# Altium schematic sheet Pre-Avionic-Design.SchDoc
size A4
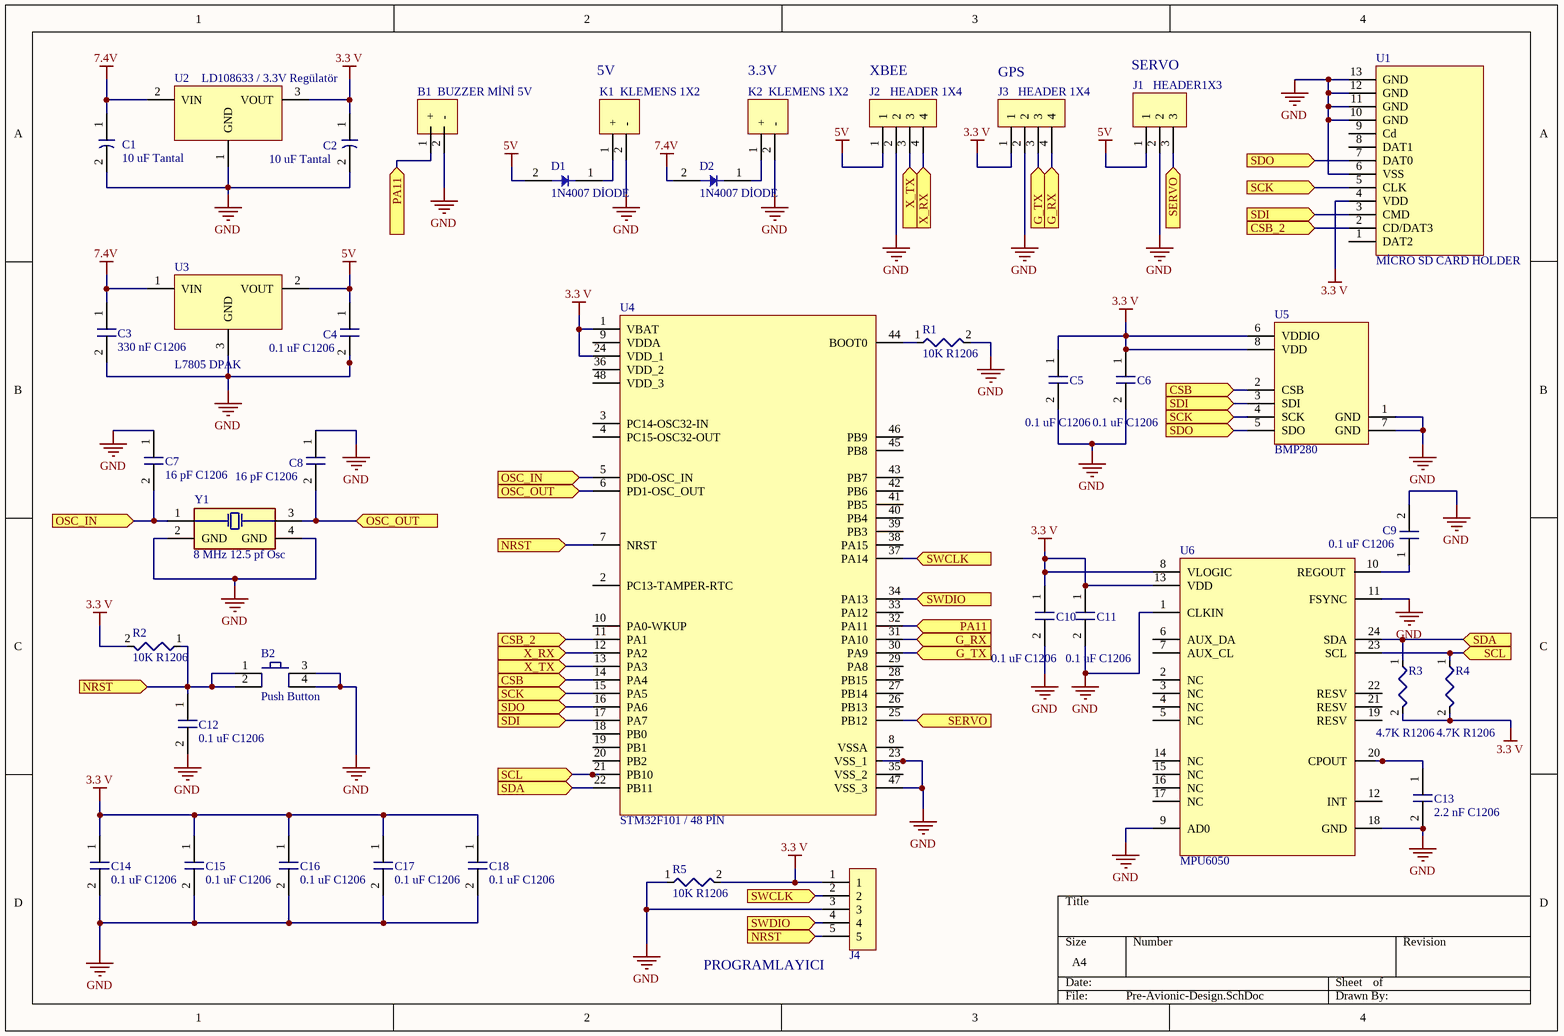
[diagram p0: Pre-Avionic-Design.SchDoc]

## Parts
B1  BUZZER MİNİ 5V  [BUZZER MİNİ]
B2  Push Button  [PUSH_BUTTON]
C1  10 uF Tantal  [C1206-tantal]
C2  10 uF Tantal  [C1206-tantal]
C3  330 nF C1206  [c1206]
C4  0.1 uF C1206  [c1206]
C5  0.1 uF C1206  [c1206]
C6  0.1 uF C1206  [c1206]
C7  16 pF C1206  [c1206]
C8  16 pF C1206  [c1206]
C9  0.1 uF C1206  [c1206]
C10  0.1 uF C1206  [c1206]
C11  0.1 uF C1206  [c1206]
C12  0.1 uF C1206  [c1206]
C13  2.2 nF C1206  [c1206]
C14  0.1 uF C1206  [c1206]
C15  0.1 uF C1206  [c1206]
C16  0.1 uF C1206  [c1206]
C17  0.1 uF C1206  [c1206]
C18  0.1 uF C1206  [c1206]
D1  1N4007 DİODE  [1N4007]
D2  1N4007 DİODE  [1N4007]
J1  HEADER1X3  [HEADER 1X3]
J2  HEADER 1X4  [Header 1x4]
J3  HEADER 1X4  [Header 1x4]
J4  HEADER 1x5  [Header 1x5]  (value not drawn)
K1  KLEMENS 1X2  [KLEMENS 1X2]
K2  KLEMENS 1X2  [KLEMENS 1X2]
R1  10K R1206  [R1206]
R2  10K R1206  [R1206]
R3  4.7K R1206  [R1206]
R4  4.7K R1206  [R1206]
R5  10K R1206  [R1206]
U1  MİCRO SD CARD HOLDER  [Micro SD Card Holder]
U2  LD108633 / 3.3V Regülatör  [LD108633 / DPAK - duplicate]
U3  L7805 DPAK  [L7805 / DPAK]
U4  STM32F101 / 48 PİN  [LQFP48-STM]
U5  BMP280  [BMP280]
U6  MPU6050  [MPU6050 / QFN]
Y1  8 MHz 12.5 pf Osc  [8 MHz OSC]

## Ports
CSB (in), CSB_2 (in), G_RX (in), G_TX (in), NRST (in), OSC_IN (in), OSC_OUT (in), PA11 (in), SCK (in), SCL (in), SDA (in), SDI (in), SDO (in), SERVO (in), SWCLK (in), SWDIO (in), X_RX (in), X_TX (in)

## Nets
3.3 V: C2.1 C5.1 C6.1 C10.1 C11.1 C14.1 C15.1 C16.1 C17.1 C18.1 J3.1 J4.1 R2.2 R3.2 R4.2 R5.2 U1.4(VDD) U2.3(VOUT) U4.1(VBAT) U4.24(VDD_1) U5.6(VDDIO) U5.8(VDD) U6.8(VLOGIC) U6.13(VDD)
5V: C4.1 D1.2 J1.1 J2.1 U3.2(VOUT)
7.4V: C1.1 C3.1 D2.2 U2.2(VIN) U3.1(VIN)
GND: B1.2(-) B2.3 B2.4 C1.2 C2.2 C3.2 C4.2 C5.2 C6.2 C7.1 C8.1 C9.2 C10.2 C11.2 C12.2 C13.2 C14.2 C15.2 C16.2 C17.2 C18.2 J1.2 J2.2 J3.2 J4.3 K1.2(-) K2.2(-) R1.2 R5.1 U1.6(VSS) U1.10(GND) U1.11(GND) U1.12(GND) U1.13(GND) U2.1(GND) U3.3(GND) U4.23(VSS_1) U4.47(VSS_3) U5.1(GND) U5.7(GND) U6.1(CLKIN) U6.9(AD0) U6.11(FSYNC) U6.18(GND) Y1.2(GND) Y1.4(GND)
CSB: U4.14(PA4) U5.2(CSB) ; port CSB
CSB_2: U1.2(CD/DAT3) U4.11(PA1) ; port CSB_2
G_RX: J3.4 U4.31(PA10) ; port G_RX
G_TX: J3.3 U4.30(PA9) ; port G_TX
NRST: B2.1 B2.2 C12.1 J4.5 R2.1 U4.7(NRST) ; port NRST
OSC_IN: C7.2 U4.5(PD0-OSC_IN) Y1.1 ; port OSC_IN
OSC_OUT: C8.2 U4.6(PD1-OSC_OUT) Y1.3 ; port OSC_OUT
PA11: B1.1(+) U4.32(PA11) ; port PA11
SCK: U1.5(CLK) U4.15(PA5) U5.4(SCK) ; port SCK
SCL: R4.1 U4.21(PB10) U6.23(SCL) ; port SCL
SDA: R3.1 U4.22(PB11) U6.24(SDA) ; port SDA
SDI: U1.3(CMD) U4.17(PA7) U5.3(SDI) ; port SDI
SDO: U1.7(DAT0) U4.16(PA6) U5.5(SDO) ; port SDO
SERVO: J1.3 U4.25(PB12) ; port SERVO
SWCLK: J4.2 U4.37(PA14) ; port SWCLK
SWDIO: J4.4 U4.34(PA13) ; port SWDIO
X_RX: J2.4 U4.12(PA2) ; port X_RX
X_TX: J2.3 U4.13(PA3) ; port X_TX
NetC9_1: C9.1 U6.10(REGOUT)
NetC13_1: C13.1 U6.20(CPOUT)
NetD1_1: D1.1 K1.1(+)
NetD2_1: D2.1 K2.1(+)
NetR1_1: R1.1 U4.44(BOOT0)

Not connected (* = marked no-connect by the designer): U1 1(DAT2) 8(DAT1) 9(Cd); U4 2(PC13-TAMPER-RTC) 3(PC14-OSC32-IN) 4(PC15-OSC32-OUT) 8(VSSA) 9(VDDA) 10(PA0-WKUP) 18(PB0) 19(PB1) 20(PB2) 26(PB13) 27(PB14) 28(PB15) 29(PA8) 33(PA12) 35(VSS_2) 36(VDD_2) 38(PA15) 39(PB3) 40(PB4) 41(PB5) 42(PB6) 43(PB7) 45(PB8) 46(PB9) 48(VDD_3); U6 2(NC) 3(NC) 4(NC) 5(NC) 6(AUX_DA) 7(AUX_CL) 12(INT) 14(NC) 15(NC) 16(NC) 17(NC) 19(RESV) 21(RESV) 22(RESV)

## Notes on the sheet
- 5V
- 3.3V
- (near J2) XBEE
- (near J3) GPS
- (near J1) SERVO
- PROGRAMLAYICI

## Library data of the parts
B1 = BUZZER MİNİ 5V: BUZZER 5V
B2 = Push Button: SMD Push Button
C4-C6 C9-C12 C14-C18 = 0.1 uF C1206: 0.1 uF 1206
J1 = HEADER1X3: Header 1x3 2.54mm
J2 J3 = HEADER 1X4: Header1x4 2.54mm
J4 = HEADER 1x5: Header 1x5 2.54mm
K1 K2 = KLEMENS 1X2: KLEMANS 1X22 3.6mm
U1 = MİCRO SD CARD HOLDER: MICRO SD CARD HOLDER
U2 = LD108633: LD108633 / 3.3 REG
U3 = L7805 DPAK: L7805 / 5V Regülatör
U4 = STM32F101
U5 = BMP280: BMP280 SENSOR
U6 = MPU6050: MPU6050 SENSOR